# Altium schematic sheet TOP.SchDoc
size A
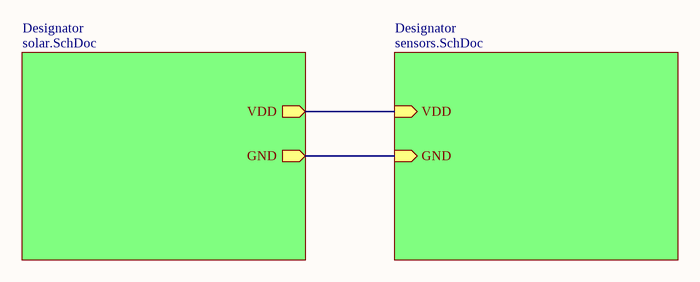
[diagram p0: TOP.SchDoc]

## Sub-sheets
Designator = solar.SchDoc: VDD (out), GND (out)
Designator = sensors.SchDoc: VDD (in), GND (in)

## Nets
(unnamed): sheet Designator/VDD, sheet Designator/VDD
(unnamed): sheet Designator/GND, sheet Designator/GND